# Altium schematic sheet Arduino EvalBoard.SchDoc: Arduino Pinout
size A3; DrawnBy: Nils Minor; Engineer: Nils Minor; DocumentNumber: 2; Revision: B.01; SheetNumber: 2; SheetTotal: 3
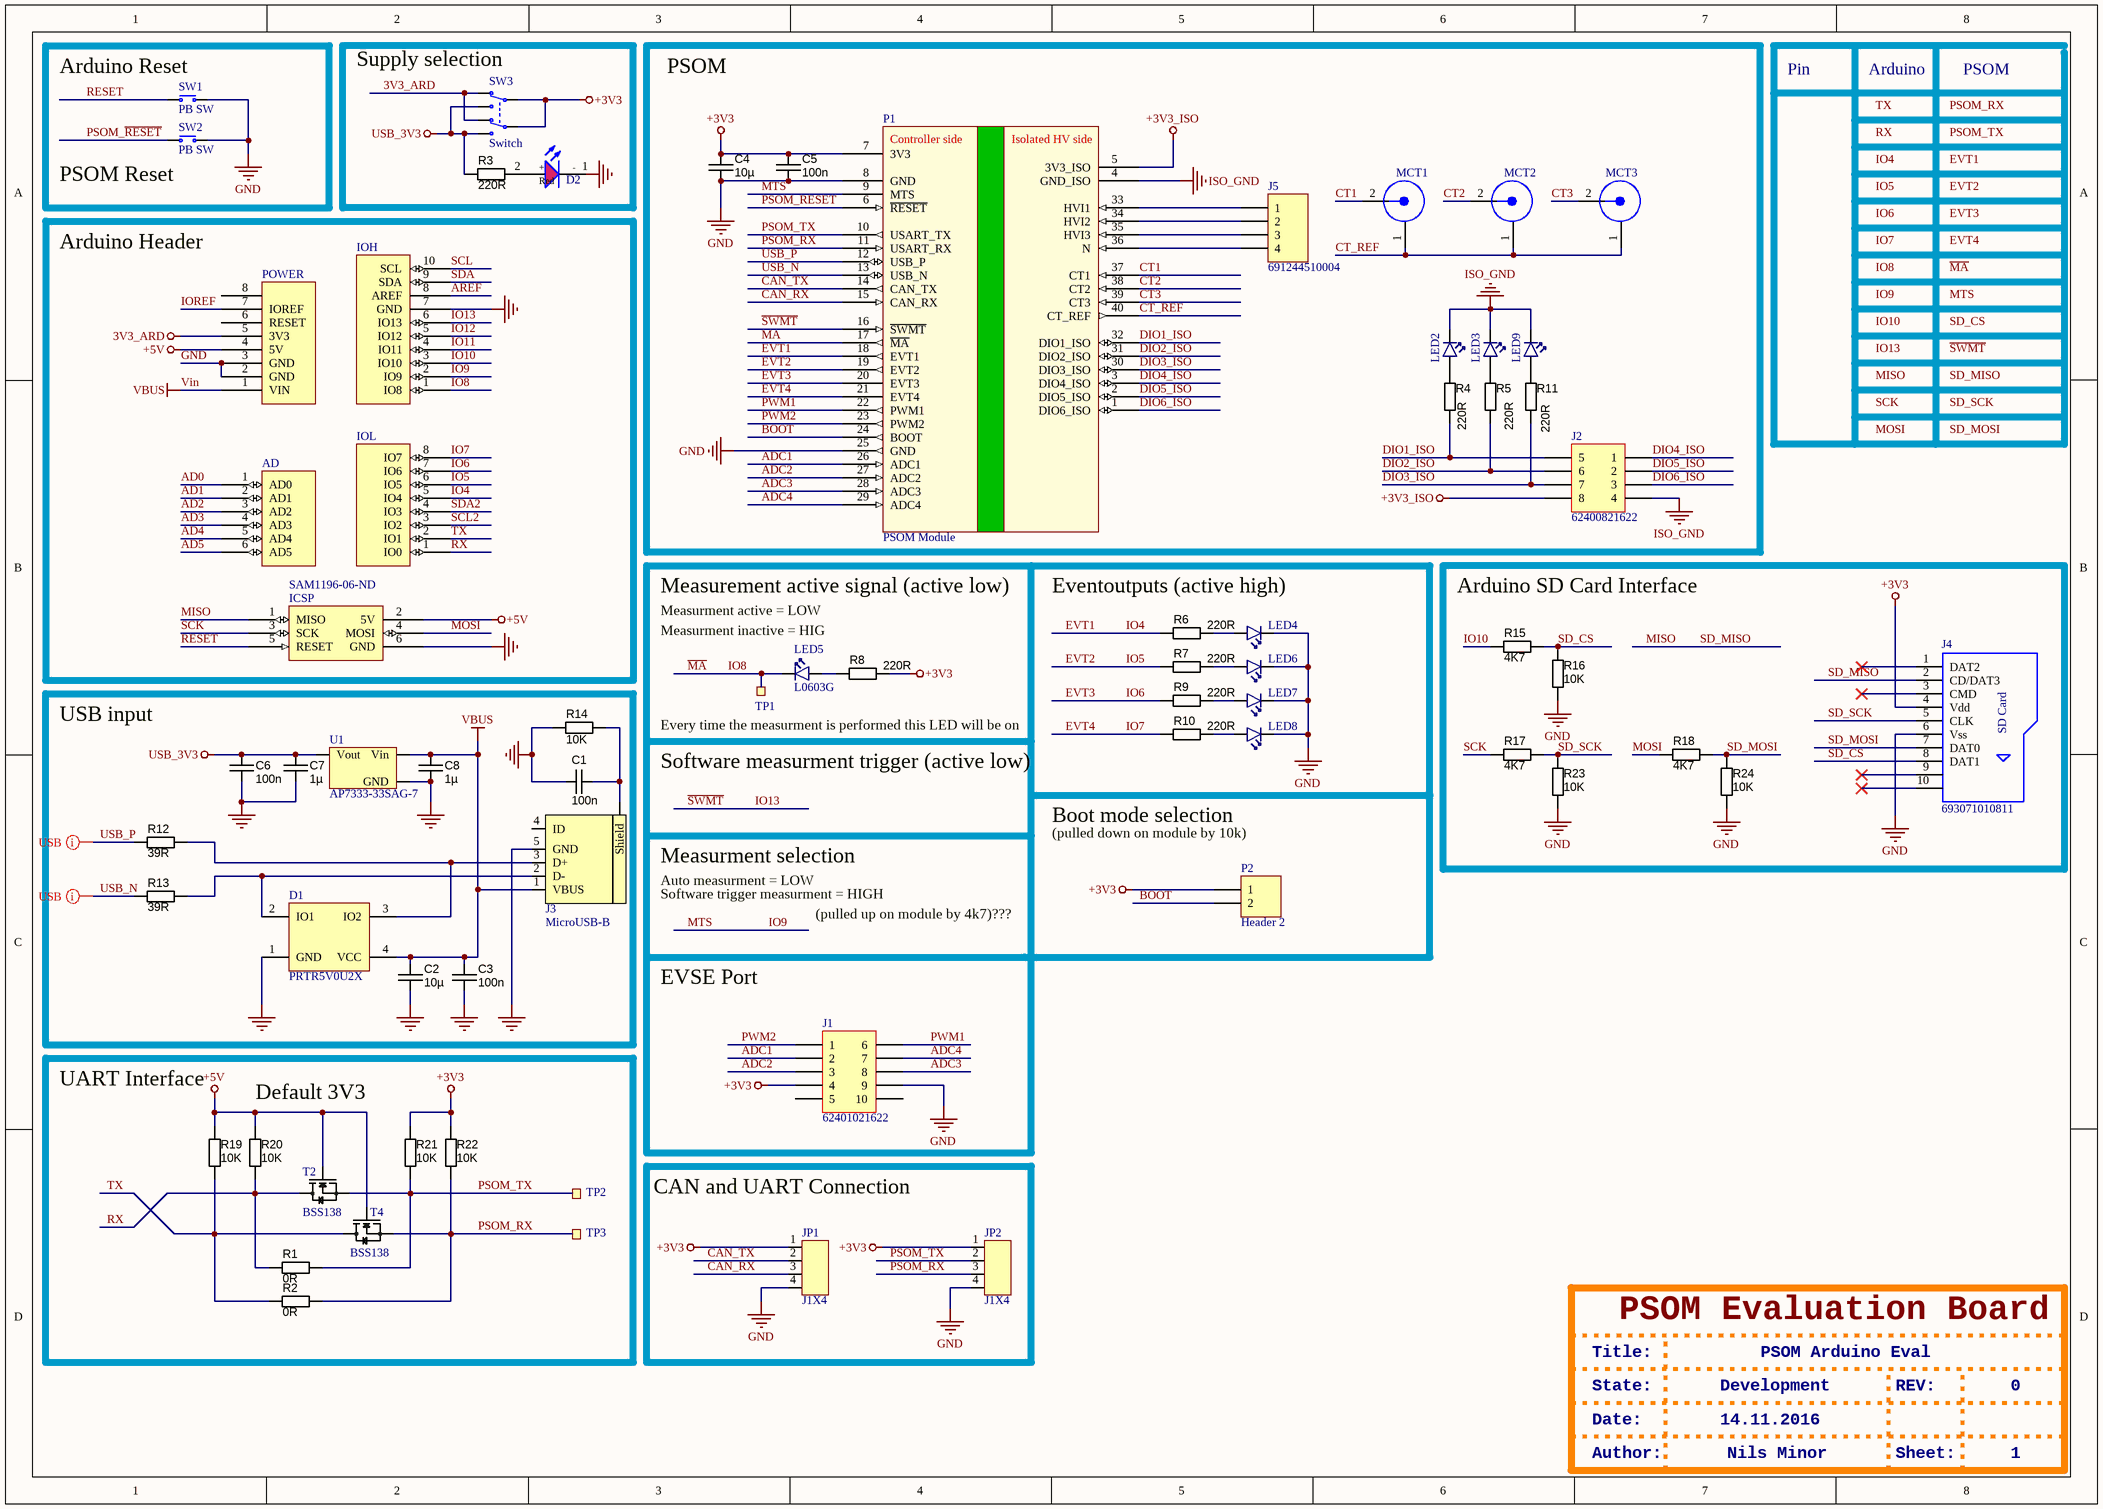
[diagram p0: Arduino EvalBoard.SchDoc]

## Parts
AD  AD  [Header 6x1 8.5mm]  (value not drawn)
C1  value 100n  [CAPC1608X90N]  (hidden comment: approved sub OK)
C2  value 10µ  [CAPC2012X135N]  (hidden comment: approved sub OK)
C3  value 100n  [CAPC1608X90N]  (hidden comment: approved sub OK)
C4  value 10µ  [CAPC2012X135N]  (hidden comment: approved sub OK)
C5  value 100n  [CAPC1608X90N]  (hidden comment: approved sub OK)
C6  value 100n  [CAPC1608X90N]  (hidden comment: approved sub OK)
C7  value 1µ  [CAPC1608X90N]  (hidden comment: approved sub OK)
C8  value 1µ  [CAPC1608X90N]  (hidden comment: approved sub OK)
D1  PRTR5V0U2X  [SOT190P230X110-4L]
D2  150060RS75000  [WL-SMCW_0603]  (value not drawn)
ICSP  Supplier Part Number 5: SAM1196-06-ND  [ICSP]  (hidden comment: ICSP)
IOH  IOH  [Header 10x1 8.5mm]  (value not drawn)
IOL  IOL  [Header 8x1 8.5mm]  (value not drawn)
J1  62401021622  [62401021622]
J2  62400821622  [62400821622]
J3  MicroUSB-B  [FCI_10118193-0001LF]
J4  693071010811  [693071010811]
J5  691244510004  [691244510004]
JP1  J1X4  [SIP4]
JP2  J1X4  [SIP4]
LED2  L0603G  [LED_0603_G]  (value not drawn)
LED3  L0603G  [LED_0603_G]  (value not drawn)
LED4  L0603G  [LED_0603_G]  (value not drawn)
LED5  L0603G  [LED_0603_G]
LED6  L0603G  [LED_0603_G]  (value not drawn)
LED7  L0603G  [LED_0603_G]  (value not drawn)
LED8  L0603G  [LED_0603_G]  (value not drawn)
LED9  L0603G  [LED_0603_G]  (value not drawn)
MCT1  (no value)  [BNC_Female]
MCT2  (no value)  [BNC_Female]
MCT3  (no value)  [BNC_Female]
P1  PSOM Module  [PSOM_SMD]
P2  Header 2  [HDR1X2]
POWER  POWER_UNO  [Header 8x1 8.5mm]  (value not drawn)
R1  value 0R  [RESC1608N_ZERO]  (hidden comment: Thick Film)  (net tie, no BOM)
R2  value 0R  [RESC1608N_ZERO]  (hidden comment: Thick Film)  (net tie, no BOM)
R3  value 220R  [RESC1608X55N]  (hidden comment: Thick Film)
R4  value 220R  [RESC1005X40N]  (hidden comment: Thick Film)
R5  value 220R  [RESC1005X40N]  (hidden comment: Thick Film)
R6  value 220R  [RESC1005X40N]  (hidden comment: Thick Film)
R7  value 220R  [RESC1005X40N]  (hidden comment: Thick Film)
R8  value 220R  [RESC1005X40N]  (hidden comment: Thick Film)
R9  value 220R  [RESC1005X40N]  (hidden comment: Thick Film)
R10  value 220R  [RESC1005X40N]  (hidden comment: Thick Film)
R11  value 220R  [RESC1005X40N]  (hidden comment: Thick Film)
R12  value 39R  [RESC1608X55N]  (hidden comment: Thick Film)
R13  value 39R  [RESC1608X55N]  (hidden comment: Thick Film)
R14  value 10K  [RESC1005X40N]  (hidden comment: Thick Film)
R15  value 4K7  [RESC1005X40N]  (hidden comment: Thick Film)
R16  value 10K  [RESC1005X40N]  (hidden comment: Thick Film)
R17  value 4K7  [RESC1005X40N]  (hidden comment: Thick Film)
R18  value 4K7  [RESC1005X40N]  (hidden comment: Thick Film)
R19  value 10K  [RESC1005X40N]  (hidden comment: Thick Film)
R20  value 10K  [RESC1005X40N]  (hidden comment: Thick Film)
R21  value 10K  [RESC1005X40N]  (hidden comment: Thick Film)
R22  value 10K  [RESC1005X40N]  (hidden comment: Thick Film)
R23  value 10K  [RESC1005X40N]  (hidden comment: Thick Film)
R24  value 10K  [RESC1005X40N]  (hidden comment: Thick Film)
SW1  PB SW  [ALPS_SKHUxxx010_WO_GND]
SW2  PB SW  [ALPS_SKHUxxx010_WO_GND]
SW3  Switch  [JS202011SCQN]
T2  BSS138  [SOT23-3]
T4  BSS138  [SOT23-3]
TP1  Ø1.0mm,SMD  [TP_SMD_Ø1.0mm]  (value not drawn)  (no BOM)
TP2  Ø1.0mm,SMD  [TP_SMD_Ø1.0mm]  (value not drawn)  (no BOM)
TP3  Ø1.0mm,SMD  [TP_SMD_Ø1.0mm]  (value not drawn)  (no BOM)
U1  AP7333-33SAG-7  [SOT-23A]

## Blocks framed on the sheet
Supply selection: D2 R3 SW3
PSOM: C4 C5 J2 J5 LED2 LED3 LED9 MCT1-MCT3 P1 R4 R5 R11
Arduino Header: AD ICSP IOH IOL POWER
Arduino SD Card Interface: J4 R15-R18 R23 R24
USB input: C1-C3 C6-C8 D1 J3 R12-R14 U1
CAN and UART Connection: JP1 JP2

## Nets
3V3_ARD: POWER.5(3V3) SW3.3(N.C-1) SW3.6(N.C-2)
+3V3: C4.1 C5.1 J1.4 J4.4(Vdd) JP1.1 JP2.1 P1.7(3V3) P2.1 R8.1 R21.2 R22.2 SW3.2(COM-1) SW3.5(COM-2)
+3V3_ISO: J2.8 P1.5(3V3_ISO)
+5V: ICSP.2(5V) POWER.4(5V) R19.2 R20.2 T2.1(G) T4.1(G)
GND: C1.1 C2.2 C3.2 C4.2 C5.2 C6.1 C7.2 C8.2 D1.1(GND) D2.1(-) ICSP.6(GND) IOH.7(GND) J1.9 J3.5(GND) J4.6(Vss) JP1.4 JP2.4 LED4.1(C) LED6.1(C) LED7.1(C) LED8.1(C) P1.8(GND) P1.25(GND) POWER.2(GND) POWER.3(GND) R14.1 R16.2 R23.2 R24.2 SW1.1(N.O) SW2.1(N.O) U1.3(GND)
ISO_GND: J2.4 LED2.1(C) LED3.1(C) LED9.1(C) P1.4(GND_ISO)
USB_3V3: C6.2 C7.1 R3.2 SW3.1(N.O-1) SW3.4(N.O-2) U1.2(Vout)
Vin: C2.1 C3.1 C8.1 D1.4(VCC) J3.1(VBUS) POWER.1(VIN) U1.1(Vin)  [also labelled VBUS]
AD0: AD.1(AD0)
AD1: AD.2(AD1)
AD2: AD.3(AD2)
AD3: AD.4(AD3)
AD4: AD.5(AD4)
AD5: AD.6(AD5)
ADC1: J1.2 P1.26(ADC1)
ADC2: J1.3 P1.27(ADC2)
ADC3: J1.8 P1.28(ADC3)
ADC4: J1.7 P1.29(ADC4)
AREF: IOH.8(AREF)
BOOT: P1.24(BOOT) P2.2
CAN_RX: JP1.3 P1.15(CAN_RX)
CAN_TX: JP1.2 P1.14(CAN_TX)
CT1: MCT1.2 P1.37(CT1)
CT2: MCT2.2 P1.38(CT2)
CT3: MCT3.2 P1.39(CT3)
CT_REF: MCT1.1 MCT2.1 MCT3.1 P1.40(CT_REF)
DIO1_ISO: J2.5 P1.32(DIO1_ISO) R4.2
DIO2_ISO: J2.6 P1.31(DIO2_ISO) R5.2
DIO3_ISO: J2.7 P1.30(DIO3_ISO) R11.2
DIO4_ISO: J2.1 P1.3(DIO4_ISO)
DIO5_ISO: J2.2 P1.2(DIO5_ISO)
DIO6_ISO: J2.3 P1.1(DIO6_ISO)
EVT1: IOL.5(IO4) P1.18(EVT1) R6.2  [also labelled IO4]
EVT2: IOL.6(IO5) P1.19(EVT2) R7.2  [also labelled IO5]
EVT3: IOL.7(IO6) P1.20(EVT3) R9.2  [also labelled IO6]
EVT4: IOL.8(IO7) P1.21(EVT4) R10.2  [also labelled IO7]
IO8: IOH.1(IO8) LED5.1(C) P1.17(~{MA}) TP1.1  [also labelled ~{MA}]
IO9: IOH.2(IO9) P1.9(MTS)  [also labelled MTS]
IO10: IOH.3(IO10) R15.2
IO11: IOH.4(IO11)
IO12: IOH.5(IO12)
IO13: IOH.6(IO13) P1.16(~{SWMT})  [also labelled ~{SWMT}]
IOREF: POWER.7(IOREF)
MISO: ICSP.1(MISO) J4.2(CD/DAT3)  [also labelled SD_MISO]
MOSI: ICSP.4(MOSI) R18.2
PSOM_~{RESET}: P1.6(~{RESET}) SW2.2(COM)
PSOM_RX: JP2.3 P1.11(USART_RX) R2.2 R22.1 T4.2(S) TP3.1
PSOM_TX: JP2.2 P1.10(USART_TX) R1.2 R21.1 T2.2(S) TP2.1
PWM1: J1.6 P1.22(PWM1)
PWM2: J1.1 P1.23(PWM2)
RESET: ICSP.5(RESET) SW1.2(COM)
RX: IOL.1(IO0) R1.1 R20.1 T2.3(D)
SCK: ICSP.3(SCK) R17.2
SCL: IOH.10(SCL)
SCL2: IOL.3(IO2)
SD_CS: J4.8(DAT1) R15.1 R16.1
SD_MOSI: J4.7(DAT0) R18.1 R24.1
SD_SCK: J4.5(CLK) R17.1 R23.1
SDA: IOH.9(SDA)
SDA2: IOL.4(IO3)
TX: IOL.2(IO1) R2.1 R19.1 T4.3(D)
USB_N: P1.13(USB_N) R13.1
USB_P: P1.12(USB_P) R12.1
NetC1_2: C1.2 J3.6(Shield) R14.2
NetD1_2: D1.2(IO1) J3.2(D-) R13.2
NetD1_3: D1.3(IO2) J3.3(D+) R12.2
NetD2_2: D2.2(+) R3.1
NetJ5_1: J5.1 P1.33(HVI1)
NetJ5_2: J5.2 P1.34(HVI2)
NetJ5_3: J5.3 P1.35(HVI3)
NetJ5_4: J5.4 P1.36(N)
NetLED2_2: LED2.2(A) R4.1
NetLED3_2: LED3.2(A) R5.1
NetLED4_2: LED4.2(A) R6.1
NetLED5_2: LED5.2(A) R8.2
NetLED6_2: LED6.2(A) R7.1
NetLED7_2: LED7.2(A) R9.1
NetLED8_2: LED8.2(A) R10.1
NetLED9_2: LED9.2(A) R11.1

Not connected (* = marked no-connect by the designer): J1 5 10; J3 4(ID); J4 1(DAT2)* 3(CMD)* 9* 10*; POWER 6(RESET) 8

## Layout directives
differential pair: USB_N, USB_P

## Notes on the sheet
- (near SW1) Arduino Reset
- Pin
- Arduino
- PSOM
- (near SW2) PSOM Reset
- Measurement active signal (active low)
- Measurment active = LOW
- Measurment inactive = HIG
- Eventoutputs (active high)
- Every time the measurment is performed this LED will be on
- Software measurment trigger (active low)
- Boot mode selection
- (near P2) (pulled down on module by 10k)
- (near J3) Measurment selection
- (near J3) Auto measurment = LOW
- (near J3) Software trigger measurment = HIGH
- (pulled up on module by 4k7)???
- EVSE Port
- UART Interface
- Default 3V3
- PSOM Evaluation Board
- Title:
- State:
- Development
- PSOM Arduino Eval
- REV:
- 0
- Date:
- Author:
- 14.11.2016
- Nils Minor
- Sheet:
- 1
- Labels drawn without touching a wire or pin: EVT1, EVT2, EVT3, EVT4, IO4, IO5, IO6, IO7, IO8, IO9, IO10, IO13, MISO, MOSI, MTS, PSOM_RX, PSOM_TX, RX, SCK, SD_CS, SD_MISO, SD_MOSI, SD_SCK, TX, ~{MA}, ~{SWMT}
- Title
- Size:
- A4
- Number:
- Time:
- Revision:
- Sheet
- of
- File:
- (in symbol 693071010811) SD Card
- (in symbol PSOM_Module_1) Controller side; Isolated HV side
- (in symbol WL-SMCW 0603, 150060RS75000) Red

## Library data of the parts
C1 C3 C5 C6 = CAPC_100n_0603_X7R_50V_10%: Capacitor SMD Cer 100nF 10% 50V X7R 0603; Manufacturer 1: AVX Corporation; Manufacturer Part Number 1: 06035C104KAT2A; Ratings: 50V; X7R; Material: ceramic; SCDType: spec; Manufacturer 2: TDK Corporation; Manufacturer Part Number 2: C1608X7R1H104K; Package / Case: 0603 (1608 Metric); Tolerance: ±10%; Supplier 1: Digi-Key; Supplier Part Number 1: 478-5052-1-ND; ComponentLink1URL: http://www.avx.com/docs/Catalogs/cx7r.pdf; ComponentLink1Description: http://www.avx.com/docs/Catalogs/cx7r.pdf; Supplier 2: Digi-Key; Supplier Part Number 2: 445-1314-1-ND; ComponentLink2URL: http://product.tdk.com/capacitor/mlcc/en/documents/mlcc_commercial_general_en.pdf; ComponentLink2Description: http://product.tdk.com/capacitor/mlcc/en/documents/mlcc_commercial_general_en.pdf
C2 C4 = CAPC_10u_0805_10V: Capacitor SMD Cer 10uF 10% 10V X5R 0805; Manufacturer 1: AVX Corporation; Manufacturer Part Number 1: 0805ZD106KAT2A; Ratings: 10V; X5R; Material: ceramic; SCDType: spec; Package / Case: 0805 (2012 metric); Tolerance: ±10%; Manufacturer 2: Kemet; Manufacturer Part Number 2: C0805C106K8PACTU; Supplier 1: Digi-Key; Supplier Part Number 1: 478-5167-1-ND; ComponentLink1URL: http://www.avx.com/docs/Catalogs/cx5r.pdf; ComponentLink1Description: http://www.avx.com/docs/Catalogs/cx5r.pdf; ComponentLink2URL: http://www.kemet.com/datasheets&C0805C106K8PACTU; ComponentLink2Description: http://www.kemet.com/datasheets&C0805C106K8PACTU; Supplier 2: Digi-Key; Supplier Part Number 2: 399-4925-1-ND
C7 C8 = CAPC_1u_0603_X7R_16V_10%: Capacitor SMD Cer 1uF 10% 16V X7R 0603; Manufacturer 1: TDK Corporation; Manufacturer Part Number 1: C1608X7R1C105K; Ratings: 16V; X7R; Material: ceramic; SCDType: spec; Package / Case: 0603 (1608 metric); Tolerance: ±10%; Supplier 1: Digi-Key; Supplier Part Number 1: 445-1604-1-ND; ComponentLink1URL: http://product.tdk.com/capacitor/mlcc/en/documents/mlcc_commercial_general_en.pdf; ComponentLink1Description: http://product.tdk.com/capacitor/mlcc/en/documents/mlcc_commercial_general_en.pdf
D1 = PRTR5V0U2X: Ultra low capacitance double rail-to-rail ESD protection diode; Manufacturer: NXP; 2nd source part number: 152-4157; Artikkelnr Noca: 10069015; Artikkelnr Simpro: N.A.; Part Number: PRTR5V0U2X; Manufacturer Part Number: PRTR5V0U2X; Datasheet: http://www.farnell.com/datasheets/109718.pdf; LatestRevisionDate: 2012-06-11; Publisher: Nordic Semiconductor; Published: 2012-06-11; Value: PRTR5V0U2X; Note: *; Supplier: Digi-Key; Supplier part number: 568-4140-1-ND; 2nd source Supplier: Farnell; Footprint Doc: SOT-143B
D2 = WL-SMCW 0603, 150060RS75000: WL-SMCW SMD chip LED top view mono-color waterclear, 0603, Red; Manufacturer: Wurth Elektronik; PartNo: 150060RS75000; ComponentLink1Description: Manufacturer; ComponentLink1URL: http://www.we-online.de; Created by: Baojun Chen; Created Date: March 2016; ComponentLink2Description: Datasheet; ComponentLink2URL: http://katalog.we-online.de/led/datasheet/150060RS75000.pdf
J1 = 62401021622: WR-WTB 2.00mm Male Dual Row Vertical Shrouded Header w. positive locking, 10 pins; Manufacturer: Wurth Elektronik; ComponentLink1 Description: Manufacturer; ComponentLink2 Description: Datasheet; NoPins: 10; Created Date: March 2016; partNo: 62401021622; ComponentLink1URL: http://www.we-online.com; ComponentLink2URL: http://katalog.we-online.de/em/datasheet/6240xx21622.pdf; Created by: Baojun Chen
J2 = 62400821622: WR-WTB 2.00mm Male Dual Row Vertical Shrouded Header w. positive locking, 8 pins; Manufacturer: Wurth Elektronik; ComponentLink1 Description: Manufacturer; ComponentLink2 Description: Datasheet; NoPins: 8; Created Date: March 2016; partNo: 62400821622; ComponentLink1URL: http://www.we-online.com; ComponentLink2URL: http://katalog.we-online.de/em/datasheet/6240xx21622.pdf; Created by: Baojun Chen
J3 = MiniUSB-AB-SMT: MicroUSB-B-SMT; Part Number: FCI 10118193-0001LF; Manufacturer: FCI; Manufacturer Part Number: 10118193-0001LF; 2nd source part number: 649-10118193-0001LF; Artikkelnr Noca: N.A.; Datasheet: http://portal.fciconnect.com/Comergent//fci/drawing/10118193.pdf; Footprint Doc: FCI_10118193-0001LF; LatestRevisionDate: 2014-10-07; Pin Count: 5; Publisher: Nordic Semiconductor; Published: 2014-10-07; Value: MicroUSB-B; Note: *; Supplier: Digi-Key; Supplier part number: 609-4616-1-ND; 2nd source Supplier: Mouser; Artikkelnr Simpro: N.A.
J4 = 693071010811: WR-CRD Micro SD Card Connector Push & Push - 8 pins; Published: June 2016; Publisher: Wurth Elektronik; ComponentLink1Description: Manufacturer; ComponentLink1URL: http://www.we-online.de; ComponentLink2Description: Datasheet; ComponentLink2URL: http://katalog.we-online.de/em/datasheet/693071010811.pdf; PartNumber: 693071010811
J5 = 691244510004: WR-TBL Serie 2445 - 5.08mm Horizontal Entry Modular w. Rising Cage Clamp, 04p; PinNumber: 04; Published: June 2016; Publisher: Wurth Elektronik; ComponentLink1Description: Manufacturer; ComponentLink1URL: http://www.we-online.de; ComponentLink2Description: Datasheet; ComponentLink2URL: http://katalog.we-online.de/em/datasheet/6912445100XX.pdf; PartNumber: 691244510004
JP1 JP2 = J1X4: Jumper 1x4, Stift, gerade, RM 2.54; Text Field1: STBGS1G36L; Text Field2: RM2,5; Text Field3: %; Text Field4: V; Text Field5: W; Text Field7: Best.-Nr.: 555647-01, Spoerle nein!!!!; Text Field8: STV-BUS 14pol. Stift, einreihig, gerade
LED2-LED9 = D:LED: LED 0603, EL19-21SYGC; Manufacturer: Everlight; Manufacturer Part Number: 19-21SYGC/S530-E1/TR8; Note: 16 mcd @ 20 mA; Artikkelnr Noca: 13019044; Artikkelnr Simpro: N.A.; Part Number: EL19-21SYGC; Datasheet: http://www.everlight.com/datasheets/19_21SYGC_S530_E2_TR8.pdf; Footprint Doc: 0603; LatestRevisionDate: 2013-06-04; Pin Count: 2; Publisher: Nordic Semiconductor; Published: 2009-05-18; Value: L0603G; Supplier: Mouser; Supplier part number: 638-1921SYGCS530; 2nd source Supplier: *; 2nd source part number: *
MCT1-MCT3 = BNC_Buchse: BNC Conector
P1 = PSOM_Module_1: Power analysis system on a module; Contact: nilsminor@web.de; Creator: Nils Minor; Version: V1; Creation Date: 14.10.2016; Information: https://github.com/NilsMinor/PSOM
P2 = Header 2: Header, 2-Pin; LatestRevisionDate: 17-Jul-2002; LatestRevisionNote: Re-released for DXP Platform.; Publisher: Altium Limited
R1 R2 = RES_0R_0603: Resistor SMD chip 0.0 Ohm 0.1W 0603; Manufacturer 1: Vishay/Dale; Manufacturer Part Number 1: CRCW06030000Z0EA; Tolerance: ±5%; Ratings: 1/10W; SCDType: spec; Package / Case: 0603 (1608metric); Supplier 1: Digi-Key; Supplier Part Number 1: 541-0.0GCT-ND; ComponentLink1URL: http://www.vishay.com/doc?20035; ComponentLink1Description: http://www.vishay.com/doc?20035; Supplier 2: Digi-Key; Supplier Part Number 2: P0.0GTR-ND; Manufacturer 2: Panasonic Electronic Components; Manufacturer Part Number 2: ERJ-3GEY0R00V; RoHS 2: RoHS Compliant; ComponentLink2URL: http://industrial.panasonic.com/www-cgi/jvcr13pz.cgi?E+PZ+3+AOA0001+ERJ3GEY0R00V+7+WW; ComponentLink2Description: http://industrial.panasonic.com/www-cgi/jvcr13pz.cgi?E+PZ+3+AOA0001+ERJ3GEY0R00V+7+WW; Supplier 3: Digi-Key; Supplier Part Number 3: 311-0.0LECT-ND; Manufacturer 3: Yageo; Manufacturer Part Number 3: AC0603JR-070RL; RoHS 3: RoHS Compliant; ComponentLink3URL: http://www.yageo.com/documents/recent/PYu-AC_51_RoHS_L_2.pdf; ComponentLink3Description: http://www.yageo.com/documents/recent/PYu-AC_51_RoHS_L_2.pdf
R3-R11 = RES_220R_0603_5%: Resistor SMD chip 220 Ohm 0.1W 5% 0603; Manufacturer 1: Yageo; Manufacturer Part Number 1: RC0603JR-07220RL; Ratings: 1/10 W; SCDType: spec; Manufacturer 5: Royal Ohm; Manufacturer Part Number 5: 0603WAJ0221; Package / Case: 0603 (1608 metric); Tolerance: ±5%; Material: Thick Film; Supplier 1: Digi-Key; Supplier Part Number 1: 311-220GRCT-ND; Supplier 2: Digi-Key; Supplier Part Number 2: P220GCT-ND; Manufacturer 2: Panasonic Electronic Components; Manufacturer Part Number 2: ERJ-3GEYJ221V; RoHS 2: RoHS Compliant; ComponentLink2URL: http://industrial.panasonic.com/www-cgi/jvcr13pz.cgi?E+PZ+3+AOA0001+ERJ3GEYJ221V+7+WW; ComponentLink2Description: http://industrial.panasonic.com/www-cgi/jvcr13pz.cgi?E+PZ+3+AOA0001+ERJ3GEYJ221V+7+WW; ComponentLink1URL: http://www.yageo.com/documents/recent/PYu-RC0603_51_RoHS_L_4.pdf; ComponentLink1Description: http://www.yageo.com/documents/recent/PYu-RC0603_51_RoHS_L_4.pdf; Supplier 3: Digi-Key; Supplier Part Number 3: RMCF0603JT220RCT-ND; Manufacturer 3: Stackpole Electronics Inc; Manufacturer Part Number 3: RMCF0603JT220R; RoHS 3: RoHS Compliant; ComponentLink3URL: http://www.seielect.com/Catalog/SEI-RMCF_RMCP.pdf; ComponentLink3Description: http://www.seielect.com/Catalog/SEI-RMCF_RMCP.pdf; Supplier 4: Digi-Key; Supplier Part Number 4: RHM220CGCT-ND; Manufacturer 4: Rohm Semiconductor; Manufacturer Part Number 4: MCR03ERTJ221; RoHS 4: RoHS Compliant; ComponentLink4URL: http://rohmfs.rohm.com/en/products/databook/datasheet/passive/resistor/chip_resistor/mcr_g.pdf; ComponentLink4Description: http://rohmfs.rohm.com/en/products/databook/datasheet/passive/resistor/chip_resistor/mcr_g.pdf; RoHS 1: RoHS Compliant
R12 R13 = RES_39R_0603_5%: Resistor SMD chip 39 Ohm 0.1W 5% 0603; Manufacturer 1: Vishay Dale; Manufacturer Part Number 1: CRCW060339R0JNEA; Ratings: 1/10 W; SCDType: spec; Package / Case: 0603 (1608 metric); Tolerance: ±5%; Manufacturer 2: Yageo; Manufacturer Part Number 2: RC0603JR-0739RL; Supplier 1: Digi-Key; Supplier Part Number 1: 541-39GCT-ND; ComponentLink1URL: http://www.vishay.com/doc?20035; ComponentLink1Description: http://www.vishay.com/doc?20035; Supplier 2: Digi-Key; Supplier Part Number 2: 311-39GRCT-ND; ComponentLink2URL: http://www.yageo.com/documents/recent/PYu-RC0603_51_RoHS_L_4.pdf; ComponentLink2Description: http://www.yageo.com/documents/recent/PYu-RC0603_51_RoHS_L_4.pdf
R14 R16 R19-R24 = RES_10K_0402_5%: Resistor SMD chip 10k Ohm 0.063W 5% 0402; Manufacturer 1: Vishay Dale; Manufacturer Part Number 1: CRCW040210K0FKED; Ratings: 1/16 W; SCDType: undef; Package / Case: 0402 (1005 Metric); Tolerance: ±5%; Manufacturer 2: Yageo; Manufacturer Part Number 2: RC0402JR-0710KL; Supplier 1: Digi-Key; Supplier Part Number 1: 541-10.0KLCT-ND; ComponentLink1URL: http://www.vishay.com/doc?20035; ComponentLink1Description: http://www.vishay.com/doc?20035; Supplier 2: Digi-Key; Supplier Part Number 2: 311-10KJRCT-ND; ComponentLink2URL: http://www.yageo.com/documents/recent/PYu-RC0402_51_RoHS_L_6.pdf; ComponentLink2Description: http://www.yageo.com/documents/recent/PYu-RC0402_51_RoHS_L_6.pdf
R15 R17 R18 = RES_4K7_0603_1%: Resistor SMD chip 4.7K Ohm 0.1W 1% 0603; Manufacturer: Yageo; Manufacturer Part Number: RC0603FR-074K7L; Ratings: 1/10W; SCDType: undef; Package / Case: 0603 (1608 Metric); Supplier 1: Digi-Key; Supplier Part Number 1: 311-4.70KHRCT-ND; Tolerance: ±1%
SW1 SW2 = SW-PB: ALPS - SKHUALE010 - Tactile Switch, SPNO, SMD, 6.5x6.2x2.5mm; Part Number: ALPS_SKHUALE010; 2nd source part number: 688-SKHUALE010; Artikkelnr Noca: 50019001; Artikkelnr Simpro: N.A.; Manufacturer: Alps; Manufacturer Part Number: SKHUALE010; Datasheet: https://www1.elfa.se/data1/wwwroot/webroot/Z_DATA/03579000.pdf; LatestRevisionDate: 2010-02-01; Pin Count: 4; Publisher: Nordic Semiconductor; Published: 2010-02-01; Value: PB SW; Note: *; Supplier: Elfa; Supplier part number: 35-790-00; 2nd source Supplier: Mouser; Footprint Doc: ALPS_SKHUxxx010_WO_GND
SW3 = SW-DPDT: SMD slide Switch (ON-ON); Manufacturer: C&K Components; 2nd source part number: 232-0019; Artikkelnr Noca: N.A.; Part Number: JS202011SCQN; Manufacturer Part Number: JS202011SCQN; Datasheet: http://www.ck-components.com/14398/js_14july11.pdf/; LatestRevisionDate: 2014-06-24; Pin Count: 6; Publisher: Nordic Semiconductor; Published: 2014-06-24; Value: Switch; Note: *; Supplier: Digi-Key; Supplier part number: 401-2002-1-ND; 2nd source Supplier: Farnell; Footprint Doc: JS202011SCQN; Artikkelnr Simpro: N.A.
T2 T4 = BSS138: N-Chanel FET,SMD; Text Field7: Best.-Nr.:; NEU:  PM / 20.10.97: *; Geändert:: *
TP1-TP3 = TESTPAD: 1.0mm circular SMD testpad; Manufacturer: Nordic Semiconductor; Artikkelnr Noca: N.A.; Part Number: TP_SMD_Ø1.0MM; Manufacturer Part Number: *; Datasheet: *; LatestRevisionDate: 2013-06-11; Pin Count: 1; Publisher: Nordic Semiconductor; Published: 2013-06-11; Value: Ø1.0mm,SMD; Note: *; Supplier: *; Supplier part number: *; 2nd source Supplier: *; 2nd source part number: *; Footprint Doc: TP_SMD_Ø1.0mm; Artikkelnr Simpro: N.A.
U1 = AP7333-XXSAG: 300mA, Low Quiescent Current, Fast Transient Low Dropout Linear Regulator; Manufacturer: Diodes Incorporated; Part Number: AP7333-33SAG-7; Manufacturer Part Number: AP7333-33SAG-7; Datasheet: http://www.diodes.com/datasheets/AP7333.pdf; Value: AP7333-33SAG-7; Supplier: Digi-Key; Supplier part number: AP7333-33SAG-7DICT-ND; Footprint Doc: SOT-23-3
AD = AD: Supplier 1: Arrow; Supplier Part Number 1: 2699089; Supplier 2: Digi-Key; Supplier Part Number 2: SAM1198-06-ND; Supplier 3: Arrow; Supplier Part Number 3: 2699088; Supplier 4: Arrow; Supplier Part Number 4: 2699075
ICSP = ICSP: Supplier 1: Arrow; Supplier Part Number 1: 2699117; Supplier 2: Arrow; Supplier Part Number 2: 2699116; Supplier 3: Digi-Key; Supplier Part Number 3: SAM1185-06-ND; Supplier 4: Arrow; Supplier Part Number 4: 2699091; Supplier 5: Digi-Key
IOH = IOH: Supplier 1: Arrow; Supplier Part Number 1: 2698803S4475693N1004; Supplier 2: Digi-Key; Supplier Part Number 2: SAM1198-10-ND; Supplier 3: Arrow; Supplier Part Number 3: 2698789
IOL = IOL: Supplier 1: Digi-Key; Supplier Part Number 1: SAM1198-08-ND; Supplier 2: Arrow; Supplier Part Number 2: 2698939; Supplier 3: Arrow; Supplier Part Number 3: 2698940; Supplier 4: Arrow; Supplier Part Number 4: 2698925
POWER = POWER_UNO: Supplier 1: Digi-Key; Supplier Part Number 1: SAM1198-08-ND; Supplier 2: Arrow; Supplier Part Number 2: 2698939; Supplier 3: Arrow; Supplier Part Number 3: 2698940; Supplier 4: Arrow; Supplier Part Number 4: 2698925